# EAGLE schematic SRB.bak (EAGLE 8.0.0)
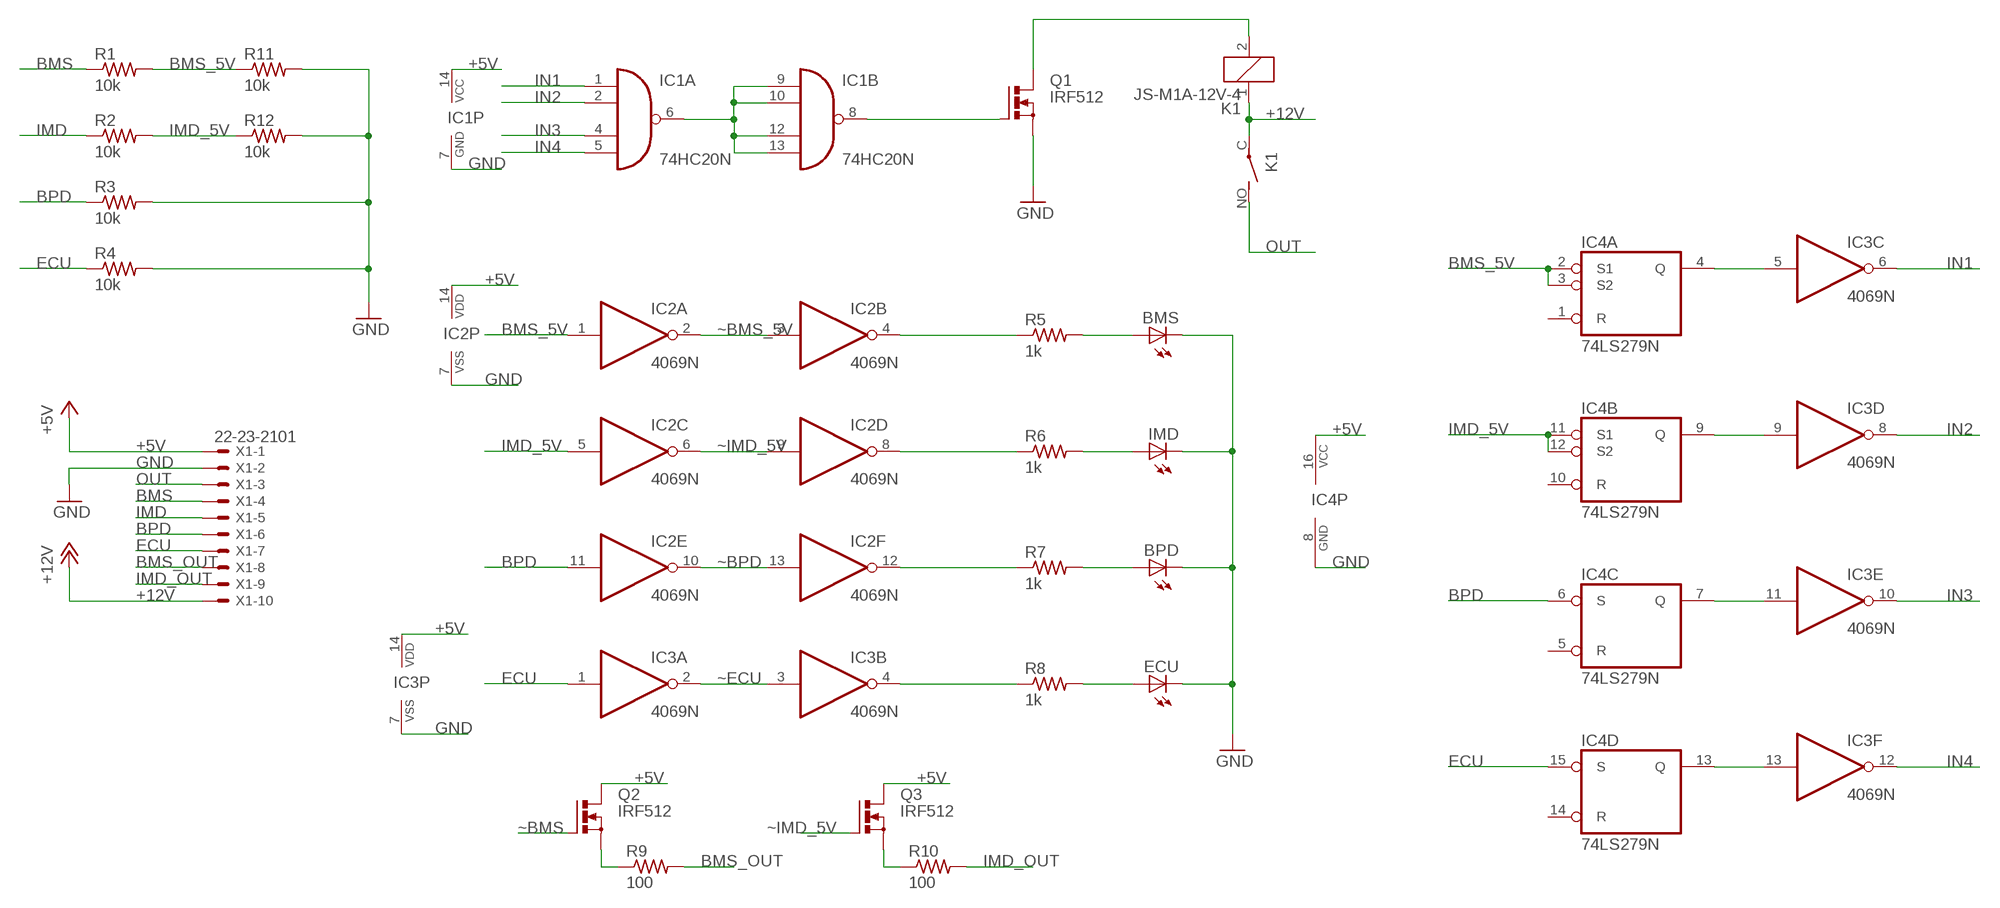
[diagram p0: schematic, sheet 1]

## Parts
BMS  LED5MM  [LED5MM]
BPD  LED5MM  [LED5MM]
ECU  LED5MM  [LED5MM]
IC1  74HC20N  [DIL14]
IC2  4069N  [DIL14]
IC3  4069N  [DIL14]
IC4  74LS279N  [DIL16]
IMD  LED5MM  [LED5MM]
K1  JS-M1A-12V-4  [JS-M1A]
Q1  IRF512  [TO220BV]
Q2  IRF512  [TO220BV]
Q3  IRF512  [TO220BV]
R1  10k  R-US_0204/7  [0204/7]
R2  10k  R-US_0204/7  [0204/7]
R3  10k  R-US_0204/7  [0204/7]
R4  10k  R-US_0204/7  [0204/7]
R5  1k  R-US_0204/7  [0204/7]
R6  1k  R-US_0204/7  [0204/7]
R7  1k  R-US_0204/7  [0204/7]
R8  1k  R-US_0204/7  [0204/7]
R9  100  R-US_0204/7  [0204/7]
R10  100  R-US_0204/7  [0204/7]
R11  10k  R-US_0204/7  [0204/7]
R12  10k  R-US_0204/7  [0204/7]
X1  22-23-2101  [22-23-2101]

## Nets
+5V: IC1.14(P:VCC) IC2.14(P:VDD) IC3.14(P:VDD) IC4.16(P:VCC) Q2.D Q3.D X1.1
+12V: K1.1 K1.C(2:P) X1.10
BMS: R1.1 X1.4
BMS_5V: IC2.1(A:I) IC4.2(A:S1) IC4.3(A:S2) R1.2 R11.1
BMS_OUT: R9.2 X1.8
BPD: IC2.11(E:I) IC4.6(C:S) R3.1 X1.6
ECU: IC3.1(A:I) IC4.15(D:S) R4.1 X1.7
GND: BMS.K(C) BPD.K(C) ECU.K(C) IC1.7(P:GND) IC2.7(P:VSS) IC3.7(P:VSS) IC4.8(P:GND) IMD.K(C) Q1.S R3.2 R4.2 R11.2 R12.2 X1.2
IMD: R2.1 X1.5
IMD_5V: IC2.5(C:I) IC4.11(B:S1) IC4.12(B:S2) R2.2 R12.1
IMD_OUT: R10.2 X1.9
IN1: IC1.1(A:I0) IC3.6(C:O)
IN2: IC1.2(A:I1) IC3.8(D:O)
IN3: IC1.4(A:I2) IC3.10(E:O)
IN4: IC1.5(A:I3) IC3.12(F:O)
N$1: IC1.6(A:O) IC1.9(B:I0) IC1.10(B:I1) IC1.12(B:I2) IC1.13(B:I3)
N$2: IC1.8(B:O) Q1.G
N$3: Q2.S R9.1
N$4: IC2.4(B:O) R5.1
N$5: IC2.8(D:O) R6.1
N$6: IC2.12(F:O) R7.1
N$7: IC3.4(B:O) R8.1
N$12: BMS.A R5.2
N$13: IMD.A R6.2
N$14: BPD.A R7.2
N$15: ECU.A R8.2
N$16: Q3.S R10.1
N$17: K1.2 Q1.D
N$18: IC3.5(C:I) IC4.4(A:Q)
N$19: IC3.9(D:I) IC4.9(B:Q)
N$20: IC3.11(E:I) IC4.7(C:Q)
N$21: IC3.13(F:I) IC4.13(D:Q)
OUT: K1.NO(2:S) X1.3
~BMS: Q2.G
~BMS_5V: IC2.2(A:O) IC2.3(B:I)
~BPD: IC2.10(E:O) IC2.13(F:I)
~ECU: IC3.2(A:O) IC3.3(B:I)
~IMD_5V: IC2.6(C:O) IC2.9(D:I) Q3.G
Unconnected: IC4.1(A:R) IC4.5(C:R) IC4.10(B:R) IC4.14(D:R)

## Library data of the parts
BMS BPD ECU IMD = led:LED: LED OSRAM: - CHIPLED LG R971, LG N971, LY N971, LG Q971, LY Q971, LO R971, LY R971 LH N974, LH R974 LS Q976, LO Q976, LY Q976 LO Q996 - Hyper CHIPLED LW Q18S LB Q993, LB Q99A, LB R99A - SideLED LS A670, LO A670, LY A670, LG A670, LP A670 LB A673, LV A673, LT A673, LW A673 LH A674 LY A675 LS A676, LA A676, LO A676, LY A676, LW A676 LS A679, LY A679, LG A679 - Hyper Micro SIDELED® LS Y876, LA Y876, LO Y876, LY Y876 LT Y87S - SmartLED LW L88C, LW L88S LB L89C, LB L89S, LG L890 LS L89K, LO L89K, LY L89K LS L896, LA L896, LO L896, LY L896 - TOPLED LS T670, LO T670, LY T670, LG T670, LP T670 LSG T670, LSP T670, LSY T670, LOP T670, LYG T670 LG T671, LOG T671, LSG T671 LB T673, LV T673, LT T673, LW T673 LH T674 LS T676, LA T676, LO T676, LY T676, LB T676, LH T676, LSB T676, LW T676 LB T67C, LV T67C, LT T67C, LS T67K, LO T67K, LY T67K, LW E67C LS E67B, LA E67B, LO E67B, LY E67B, LB E67C, LV E67C, LT E67C LW T67C LS T679, LY T679, LG T679 LS T770, LO T770, LY T770, LG T770, LP T770 LB T773, LV T773, LT T773, LW T773 LH T774 LS E675, LA E675, LY E675, LS T675 LS T776, LA T776, LO T776, LY T776, LB T776 LHGB T686 LT T68C, LB T68C - Hyper Mini TOPLED® LB M676 - Mini TOPLED Santana® LG M470 LS M47K, LO M47K, LY M47K Source: http://www.osram.convergy.de LUXEON: - LUMILED® LXK2-PW12-R00, LXK2-PW12-S00, LXK2-PW14-U00, LXK2-PW14-V00 LXK2-PM12-R00, LXK2-PM12-S00, LXK2-PM14-U00 LXK2-PE12-Q00, LXK2-PE12-R00, LXK2-PE12-S00, LXK2-PE14-T00, LXK2-PE14-U00 LXK2-PB12-K00, LXK2-PB12-L00, LXK2-PB12-M00, LXK2-PB14-N00, LXK2-PB14-P00, LXK2-PB14-Q00 LXK2-PR12-L00, LXK2-PR12-M00, LXK2-PR14-Q00, LXK2-PR14-R00 LXK2-PD12-Q00, LXK2-PD12-R00, LXK2-PD12-S00 LXK2-PH12-R00, LXK2-PH12-S00 LXK2-PL12-P00, LXK2-PL12-Q00, LXK2-PL12-R00 Source: www.luxeon.com KINGBRIGHT: KA-3528ASYC Source: www.kingbright.com
IC1 = 74xx-eu:74*20: Dual 4-input NAND gate
IC2 IC3 = 40xx:4069: Hex INVERTER
IC4 = 74xx-us:74*279: Quadruple S-R LATCH
K1 = relay:JS-M1A*: Automotive Ultra-Miniature Power Relay NAiS Source: http://www.mew-europe.com/.. en_ds_61211_0000.pdf; MPN: JSM1A-12V-4; OC_FARNELL: unknown; OC_NEWARK: 13P4554
Q1-Q3 = transistor-power:IRF512: N-CHANNEL MOS FET
R1-R12 = resistor:R-US_: RESISTOR, American symbol
X1 = con-molex:22-23-2101: .100" (2.54mm) Center Header - 10 Pin; MF: MOLEX; MPN: 22-23-2101; OC_FARNELL: 1756828; OC_NEWARK: 94C0765